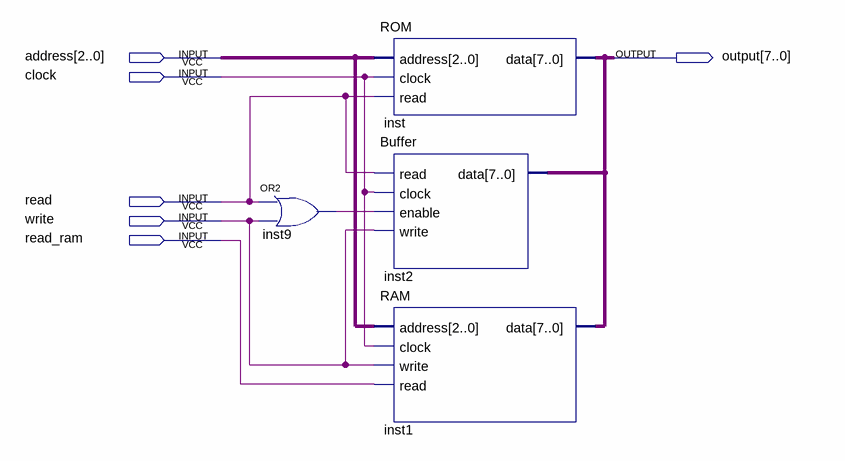
[diagram p0: schematic sheet]
// Quartus schematic L3.bdf as structural Verilog: 4 symbols, 6 pins
module L3 (
  input  [2:0] address,
  input  clock,
  input  read,
  input  write,
  input  read_ram,
  output [7:0] \output 
);

  wire inst9_out;

  or inst9 (inst9_out, read, write);
  ROM inst (.address(address), .clock(clock), .read(read), .data(\output ));
  Buffer inst2 (.read(read), .clock(clock), .enable(inst9_out), .write(write), .data(\output ));
  RAM inst1 (.address(address), .clock(clock), .write(write), .read(read_ram), .data(\output ));
endmodule
